# Altium project LeVentilateur.PrjPcb (part 2 of 4)

## Sheet 02-MCU.SchDoc: MCU
size A4
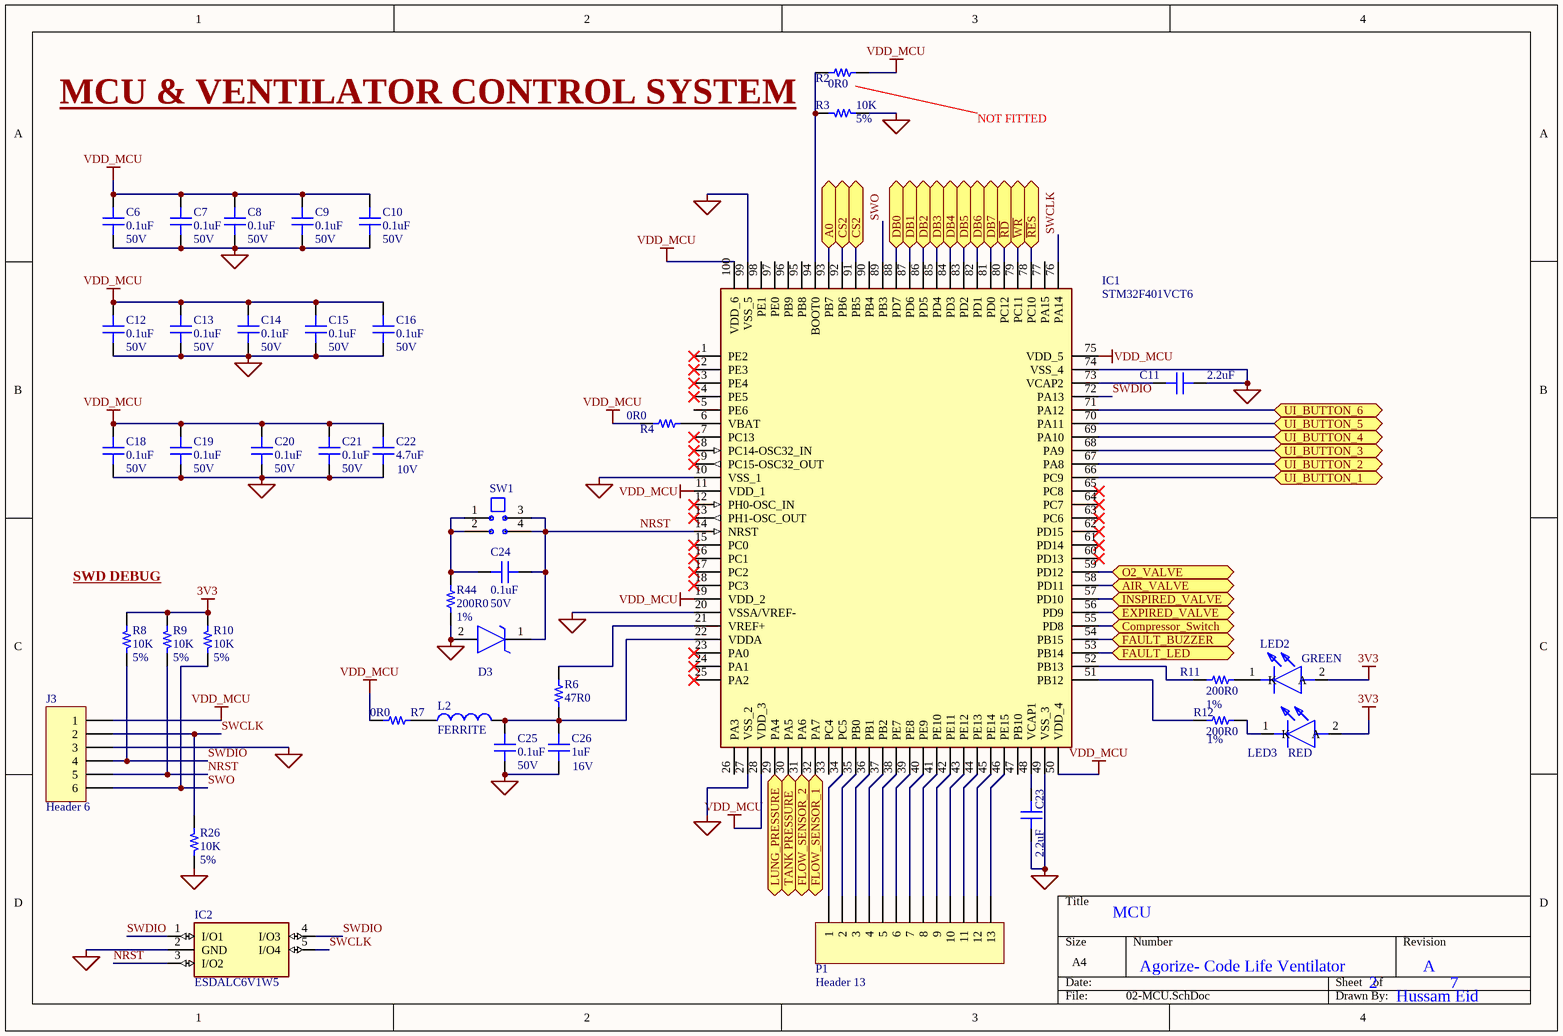
[diagram p1: 02-MCU.SchDoc]

### Parts
C6  0.1uF  Voltage Rating: 50V  [CAP 0603/1608]
C7  0.1uF  Voltage Rating: 50V  [CAP 0603/1608]
C8  0.1uF  Voltage Rating: 50V  [CAP 0603/1608]
C9  0.1uF  Voltage Rating: 50V  [CAP 0603/1608]
C10  0.1uF  Voltage Rating: 50V  [CAP 0603/1608]
C11  2.2uF  [CAP 0603/1608]
C12  0.1uF  Voltage Rating: 50V  [CAP 0603/1608]
C13  0.1uF  Voltage Rating: 50V  [CAP 0603/1608]
C14  0.1uF  Voltage Rating: 50V  [CAP 0603/1608]
C15  0.1uF  Voltage Rating: 50V  [CAP 0603/1608]
C16  0.1uF  Voltage Rating: 50V  [CAP 0603/1608]
C18  0.1uF  Voltage Rating: 50V  [CAP 0603/1608]
C19  0.1uF  Voltage Rating: 50V  [CAP 0603/1608]
C20  0.1uF  Voltage Rating: 50V  [CAP 0603/1608]
C21  0.1uF  Voltage Rating: 50V  [CAP 0603/1608]
C22  4.7uF  Voltage Rating: 10V  [CAP 0603/1608]
C23  2.2uF  [CAP 0603/1608]
C24  0.1uF  Voltage Rating: 50V  [CAP 0603/1608]
C25  0.1uF  Voltage Rating: 50V  [CAP 0603/1608]
C26  1uF  Voltage Rating (DC): 16V  [CAP 0603/1608]
D3  ESDALC6V1-1U2  [ESDALC6V11U2]  (value not drawn)
IC1  STM32F401VCT6  [QFP50P1600X1600X160-100N]
IC2  ESDALC6V1W5  [SOT65P210X110-5N]
J3  Header 6  [HDR1X6]
L2  FERRITE  [BEADC1608X95N]
LED2  GREEN  [150060GS73220]
LED3  RED  [150060GS73220]
P1  Header 13  [HDR1X13]
R2  0R0  [RES 0603/1608]
R3  10K  Tolerance: 5%  [RES 0603/1608]
R4  0R0  [RES 0603/1608]
R6  47R0  [RES 0603/1608]
R7  0R0  [RES 0603/1608]
R8  10K  Tolerance: 5%  [RES 0603/1608]
R9  10K  Tolerance: 5%  [RES 0603/1608]
R10  10K  Tolerance: 5%  [RES 0603/1608]
R11  200R0  Tolerance: 1%  [RES 1206/3216]
R12  200R0  Tolerance: 1%  [RES 1206/3216]
R26  10K  Tolerance: 5%  [RES 0603/1608]
R44  200R0  Tolerance: 1%  [RES 1206/3216]
SW1  Tactle switch  [PTS526SM15SMTR2LFS]  (value not drawn)

### Ports
A0 (bidir), AIR_VALVE (bidir), Compressor_Switch (bidir), CS2 (bidir), DB0 (bidir), DB1 (bidir), DB2 (bidir), DB3 (bidir), DB4 (bidir), DB5 (bidir), DB6 (bidir), DB7 (bidir), EXPIRED_VALVE (bidir), FAULT_BUZZER (bidir), FAULT_LED (bidir), FLOW_SENSOR_1 (bidir), FLOW_SENSOR_2 (bidir), INSPIRED_VALVE (bidir), LUNG_PRESSURE (bidir), O2_VALVE (bidir), TANK PRESSURE (bidir), UI_BUTTON_1 (bidir), UI_BUTTON_2 (bidir), UI_BUTTON_3 (bidir), UI_BUTTON_4 (bidir), UI_BUTTON_5 (bidir), UI_BUTTON_6 (bidir), ~{RD} (bidir), ~{RE}S (bidir), ~{WR} (bidir)

### Nets
3V3: LED2.2(A) LED3.2(A) R8.1 R9.1 R10.1
COM: C6.2 C7.2 C8.2 C9.2 C10.2 C11.2 C12.2 C13.2 C14.2 C15.2 C16.2 C18.2 C19.2 C20.2 C21.2 C22.2 C23.1 C25.2 C26.2 D3.2(A) IC1.10(VSS_1) IC1.20(VSSA/VREF-) IC1.27(VSS_2) IC1.49(VSS_3) IC1.74(VSS_4) IC1.99(VSS_5) IC2.2(GND) J3.3 R3.1 R26.1 R44.1
VDD_MCU: C6.1 C7.1 C8.1 C9.1 C10.1 C12.1 C13.1 C14.1 C15.1 C16.1 C18.1 C19.1 C20.1 C21.1 C22.1 IC1.11(VDD_1) IC1.19(VDD_2) IC1.28(VDD_3) IC1.50(VDD_4) IC1.75(VDD_5) IC1.100(VDD_6) J3.1 R2.2 R4.1 R7.1
NRST: C24.2 D3.1(K) IC1.14(NRST) IC2.3(I/O2) J3.5 R9.2 SW1.3 SW1.4
SWCLK: IC1.76(PA14) IC2.5(I/O4) J3.2 R26.2
SWDIO: IC1.72(PA13) IC2.1(I/O1) IC2.4(I/O3) J3.4 R8.2
SWO: IC1.89(PB3) J3.6 R10.2
NetC11_1: C11.1 IC1.73(VCAP2)
NetC23_2: C23.2 IC1.48(VCAP1)
NetC24_1: C24.1 R44.2 SW1.1 SW1.2
NetC25_1: C25.1 C26.1 IC1.22(VDDA) L2.2 R6.1
NetC55_1: IC1.66(PC9) ; port UI_BUTTON_1
NetC56_1: IC1.67(PA8) ; port UI_BUTTON_2
NetC57_1: IC1.68(PA9) ; port UI_BUTTON_3
NetC58_1: IC1.69(PA10) ; port UI_BUTTON_4
NetC59_1: IC1.70(PA11) ; port UI_BUTTON_5
NetC60_1: IC1.71(PA12) ; port UI_BUTTON_6
NetIC1_6: IC1.6(VBAT) R4.2
NetIC1_21: IC1.21(VREF+) R6.2
NetIC1_29: IC1.29(PA4) ; port LUNG_PRESSURE
NetIC1_30: IC1.30(PA5) ; port TANK PRESSURE
NetIC1_31: IC1.31(PA6) ; port FLOW_SENSOR_2
NetIC1_32: IC1.32(PA7) ; port FLOW_SENSOR_1
NetIC1_34: IC1.34(PC5) P1.1
NetIC1_35: IC1.35(PB0) P1.2
NetIC1_36: IC1.36(PB1) P1.3
NetIC1_37: IC1.37(PB2) P1.4
NetIC1_38: IC1.38(PE7) P1.5
NetIC1_39: IC1.39(PE8) P1.6
NetIC1_40: IC1.40(PE9) P1.7
NetIC1_41: IC1.41(PE10) P1.8
NetIC1_42: IC1.42(PE11) P1.9
NetIC1_43: IC1.43(PE12) P1.10
NetIC1_44: IC1.44(PE13) P1.11
NetIC1_45: IC1.45(PE14) P1.12
NetIC1_46: IC1.46(PE15) P1.13
NetIC1_51: IC1.51(PB12) R12.1
NetIC1_52: IC1.52(PB13) R11.1
NetIC1_53: IC1.53(PB14) ; port FAULT_LED
NetIC1_54: IC1.54(PB15) ; port FAULT_BUZZER
NetIC1_55: IC1.55(PD8) ; port Compressor_Switch
NetIC1_56: IC1.56(PD9) ; port EXPIRED_VALVE
NetIC1_57: IC1.57(PD10) ; port INSPIRED_VALVE
NetIC1_58: IC1.58(PD11) ; port AIR_VALVE
NetIC1_59: IC1.59(PD12) ; port O2_VALVE
NetIC1_78: IC1.78(PC10) ; port ~{RE}S
NetIC1_79: IC1.79(PC11) ; port ~{WR}
NetIC1_80: IC1.80(PC12) ; port ~{RD}
NetIC1_81: IC1.81(PD0) ; port DB7
NetIC1_82: IC1.82(PD1) ; port DB6
NetIC1_83: IC1.83(PD2) ; port DB5
NetIC1_84: IC1.84(PD3) ; port DB4
NetIC1_85: IC1.85(PD4) ; port DB3
NetIC1_86: IC1.86(PD5) ; port DB2
NetIC1_87: IC1.87(PD6) ; port DB1
NetIC1_88: IC1.88(PD7) ; port DB0
NetIC1_91: IC1.91(PB5) IC1.92(PB6) ; port CS2
NetIC1_93: IC1.93(PB7) ; port A0
NetIC1_94: IC1.94(BOOT0) R2.1 R3.2
NetL2_1: L2.1 R7.2
NetLED2_1: LED2.1(K) R11.2
NetLED3_1: LED3.1(K) R12.2

Not connected (* = marked no-connect by the designer): IC1 1(PE2)* 2(PE3)* 3(PE4)* 4(PE5)* 5(PE6) 7(PC13)* 8(PC14-OSC32_IN)* 9(PC15-OSC32_OUT)* 12(PH0-OSC_IN)* 13(PH1-OSC_OUT)* 15(PC0)* 16(PC1)* 17(PC2)* 18(PC3)* 23(PA0)* 24(PA1)* 25(PA2)* 26(PA3) 33(PC4) 47(PB10) 60(PD13)* 61(PD14)* 62(PD15)* 63(PC6)* 64(PC7)* 65(PC8)* 77(PA15) 90(PB4) 95(PB8) 96(PB9) 97(PE0) 98(PE1)

### Notes on the sheet
- MCU & VENTILATOR CONTROL SYSTEM
- NOT FITTED
- SWD DEBUG
- MCU
- Agorize- Code Life Ventilator
- 2
- A
- 7
- Hussam Eid

### Library data of the parts
C6-C10 C12-C16 C18-C21 C24 C25 = C1608X7R1E104K080AA: CAP CER 0.1UF 50V X7R 0603; Manufacturer 1: KEMET; Manufacturer Part Number 1: C0603C104M5RACTU; Description 1: Cap Ceramic 0.1uF 50V X7R 20% SMD 0603 125C T/R; Dielectric Material: Ceramic; Capacitance: 100nF; Tolerance: 20%; Dissipation Factor: 2.5%; ComponentLink1Description: Datasheet; ComponentLink1URL: https://product.tdk.com/info/en/catalog/datasheets/mlcc_commercial_general_en.pdf; ComponentLink2Description: Digi-Key listing; ComponentLink2URL: http://digikey.com/product-detail/en/C1608X7R1E104K080AA/445-1316-1-ND/567697; Supplier 1: Digi-Key; Supplier Part Number 1: 399-7845-1-ND; RoHS 1: Yes; Stock 1: 3475152; Pricing 1: 1 = 0.10000, 10 = 0.03900, 100 = 0.01740, 500 = 0.01240, 1000 = 0.00974 (USD); Mount: Surface Mount,PCB; Case/Package: 0603; Contact Plating: Tin,Matte; Case Code (Metric): 1608; Case Code (Imperial): 0603; Min Operating Temperature: -55°C; Max Operating Temperature: 125°C; Dielectric: X7R; Termination: SMD/SMT; Package Quantity: 1; Packaging: Tape and Reel; Voltage Rating (DC): 50V; Length: 1.6mm; Height: 0.8mm; Thickness: 0.034inch; Lead Pitch: 0.7mm; Depth: 0.8mm; Width: 0.031inch; Radiation Hardening: No; REACH SVHC: No SVHC; ComponentLink3URL: https://www.verical.com/server-webapp/html/getDatasheet?partID=626892&src-supplier=Verical; ComponentLink3Description: https://www.verical.com/server-webapp/html/getDatasheet?partID=626892&src-supplier=Verical; ComponentLink4URL: http://www.farnell.com/datasheets/2746056.pdf?src-supplier=Farnell; ComponentLink4Description: http://www.farnell.com/datasheets/2746056.pdf?src-supplier=Farnell; ComponentLink5URL: http://components.arrow.com/part/dataview/0323_00313986?src-supplier=Arrow+Europe; ComponentLink5Description: http://components.arrow.com/part/dataview/0323_00313986?src-supplier=Arrow+Europe; ComponentLink6URL: http://www.mouser.com/ds/2/212/KEM_C1002_X7R_SMD-1102033.pdf?src-supplier=Mouser; ComponentLink6Description: http://www.mouser.com/ds/2/212/KEM_C1002_X7R_SMD-1102033.pdf?src-supplier=Mouser; ComponentLink7URL: http://www.alliedelec.com/m/d/6f3b5eb83d09db50ed28bdc730567b33.pdf?src-supplier=Allied+Electronics; ComponentLink7Description: http://www.alliedelec.com/m/d/6f3b5eb83d09db50ed28bdc730567b33.pdf?src-supplier=Allied+Electronics; ComponentLink8URL: http://components.arrow.com/part/dataview/40911037S8853915N7429?src-supplier=Arrow; ComponentLink8Description: http://components.arrow.com/part/dataview/40911037S8853915N7429?src-supplier=Arrow; ComponentLink9URL: http://www.farnell.com/datasheets/2746056.pdf?src-supplier=Newark; ComponentLink9Description: http://www.farnell.com/datasheets/2746056.pdf?src-supplier=Newark; ComponentLink10URL: http://www.farnell.com/datasheets/1828800.pdf?src-supplier=Newark; ComponentLink10Description: http://www.farnell.com/datasheets/1828800.pdf?src-supplier=Newark; ComponentLink11URL: http://capacitoredge.kemet.com/capedge2/DataSheet?pn=C0603C104M5RAC7867&src-supplier=Avnet+Asia; ComponentLink11Description: http://capacitoredge.kemet.com/capedge2/DataSheet?pn=C0603C104M5RAC7867&src-supplier=Avnet+Asia; ComponentLink12URL: https://api.kemet.com/component-edge/download/datasheet/C0603C104M5RACTU.pdf?src-supplier=Digi-Key; ComponentLink12Description: https://api.kemet.com/component-edge/download/datasheet/C0603C104M5RACTU.pdf?src-supplier=Digi-Key; ComponentLink13URL: https://www.verical.com/server-webapp/html/getDatasheet?partID=110138&src-supplier=Verical; ComponentLink13Description: https://www.verical.com/server-webapp/html/getDatasheet?partID=110138&src-supplier=Verical; ComponentLink14URL: http://capacitoredge.kemet.com/capedge2/DataSheet?pn=C0603C104M5RAC7867&src-supplier=Avnet; ComponentLink14Description: http://capacitoredge.kemet.com/capedge2/DataSheet?pn=C0603C104M5RAC7867&src-supplier=Avnet; ComponentLink15URL: http://www.farnell.com/datasheets/2315113.pdf?src-supplier=Newark; ComponentLink15Description: http://www.farnell.com/datasheets/2315113.pdf?src-supplier=Newark; ComponentLink16URL: http://www.farnell.com/datasheets/2746056.pdf?src-supplier=Element14; ComponentLink16Description: http://www.farnell.com/datasheets/2746056.pdf?src-supplier=Element14
C11 C23 = C1608X7R1E104K080AA: CAP CER 2.2UF 16V X5R 0603; Manufacturer 1: KEMET; Manufacturer Part Number 1: C0603C225K4PACTU; Description 1: KEMET - C0603C225K4PACTU - CAP, MLCC, X5R, 2.2UF, 16V, 0603; Dielectric Material: Ceramic; Dissipation Factor: 5%; Tolerance: 10%; ComponentLink1Description: Datasheet; ComponentLink1URL: https://product.tdk.com/info/en/catalog/datasheets/mlcc_commercial_general_en.pdf; ComponentLink2Description: Digi-Key listing; ComponentLink2URL: http://digikey.com/product-detail/en/C1608X7R1E104K080AA/445-1316-1-ND/567697; ComponentLink3URL: https://www.verical.com/server-webapp/html/getDatasheet?partID=626892&src-supplier=Verical; ComponentLink3Description: https://www.verical.com/server-webapp/html/getDatasheet?partID=626892&src-supplier=Verical; ComponentLink4URL: http://www.farnell.com/datasheets/2746056.pdf?src-supplier=Farnell; ComponentLink4Description: http://www.farnell.com/datasheets/2746056.pdf?src-supplier=Farnell; ComponentLink5URL: http://components.arrow.com/part/dataview/0323_00313986?src-supplier=Arrow+Europe; ComponentLink5Description: http://components.arrow.com/part/dataview/0323_00313986?src-supplier=Arrow+Europe; ComponentLink6URL: http://www.mouser.com/ds/2/212/KEM_C1002_X7R_SMD-1102033.pdf?src-supplier=Mouser; ComponentLink6Description: http://www.mouser.com/ds/2/212/KEM_C1002_X7R_SMD-1102033.pdf?src-supplier=Mouser; ComponentLink7URL: http://www.alliedelec.com/m/d/6f3b5eb83d09db50ed28bdc730567b33.pdf?src-supplier=Allied+Electronics; ComponentLink7Description: http://www.alliedelec.com/m/d/6f3b5eb83d09db50ed28bdc730567b33.pdf?src-supplier=Allied+Electronics; ComponentLink8URL: http://components.arrow.com/part/dataview/40911037S8853915N7429?src-supplier=Arrow; ComponentLink8Description: http://components.arrow.com/part/dataview/40911037S8853915N7429?src-supplier=Arrow; ComponentLink9URL: http://www.farnell.com/datasheets/2746056.pdf?src-supplier=Newark; ComponentLink9Description: http://www.farnell.com/datasheets/2746056.pdf?src-supplier=Newark; ComponentLink10URL: http://www.farnell.com/datasheets/1828800.pdf?src-supplier=Newark; ComponentLink10Description: http://www.farnell.com/datasheets/1828800.pdf?src-supplier=Newark; ComponentLink11URL: http://capacitoredge.kemet.com/capedge2/DataSheet?pn=C0603C104M5RAC7867&src-supplier=Avnet+Asia; ComponentLink11Description: http://capacitoredge.kemet.com/capedge2/DataSheet?pn=C0603C104M5RAC7867&src-supplier=Avnet+Asia; ComponentLink12URL: https://api.kemet.com/component-edge/download/datasheet/C0603C104M5RACTU.pdf?src-supplier=Digi-Key; ComponentLink12Description: https://api.kemet.com/component-edge/download/datasheet/C0603C104M5RACTU.pdf?src-supplier=Digi-Key; ComponentLink13URL: https://www.verical.com/server-webapp/html/getDatasheet?partID=110138&src-supplier=Verical; ComponentLink13Description: https://www.verical.com/server-webapp/html/getDatasheet?partID=110138&src-supplier=Verical; ComponentLink14URL: http://capacitoredge.kemet.com/capedge2/DataSheet?pn=C0603C104M5RAC7867&src-supplier=Avnet; ComponentLink14Description: http://capacitoredge.kemet.com/capedge2/DataSheet?pn=C0603C104M5RAC7867&src-supplier=Avnet; ComponentLink15URL: http://www.farnell.com/datasheets/2315113.pdf?src-supplier=Newark; ComponentLink15Description: http://www.farnell.com/datasheets/2315113.pdf?src-supplier=Newark; ComponentLink16URL: http://www.farnell.com/datasheets/2746056.pdf?src-supplier=Element14; ComponentLink16Description: http://www.farnell.com/datasheets/2746056.pdf?src-supplier=Element14; ComponentLink17URL: https://datasheet.ciiva.com/30054/131lmk107bj475ka-t-30054339.pdf?src-supplier=Onlinecomponents.com; ComponentLink17Description: https://datasheet.ciiva.com/30054/131lmk107bj475ka-t-30054339.pdf?src-supplier=Onlinecomponents.com; ComponentLink18URL: https://datasheet.ciiva.com/11463/lmk107bj475ka-t-ss-11463768.pdf?src-supplier=Avnet; ComponentLink18Description: https://datasheet.ciiva.com/11463/lmk107bj475ka-t-ss-11463768.pdf?src-supplier=Avnet; ComponentLink19URL: https://datasheet.ciiva.com/135/lmk107bj475ka-t-ss-135643.pdf?src-supplier=Digi-Key; ComponentLink19Description: https://datasheet.ciiva.com/135/lmk107bj475ka-t-ss-135643.pdf?src-supplier=Digi-Key; ComponentLink20URL: https://datasheet.ciiva.com/26872/getdatasheetpartid-638615-26872655.pdf?src-supplier=Verical; ComponentLink20Description: https://datasheet.ciiva.com/26872/getdatasheetpartid-638615-26872655.pdf?src-supplier=Verical; ComponentLink21URL: https://datasheet.ciiva.com/15921/344lmk107bj475ka-t-15921264.pdf?src-supplier=Onlinecomponents.com; ComponentLink21Description: https://datasheet.ciiva.com/15921/344lmk107bj475ka-t-15921264.pdf?src-supplier=Onlinecomponents.com; ComponentLink22URL: https://datasheet.ciiva.com/5424/mlcc01-e-5424565.pdf?src-supplier=Mouser; ComponentLink22Description: https://datasheet.ciiva.com/5424/mlcc01-e-5424565.pdf?src-supplier=Mouser; ComponentLink23URL: https://datasheet.ciiva.com/7975/746258-7975564.pdf?src-supplier=Element14; ComponentLink23Description: https://datasheet.ciiva.com/7975/746258-7975564.pdf?src-supplier=Element14; Supplier 1: Digi-Key; Supplier Part Number 1: 399-7886-1-ND; RoHS 1: Yes; Stock 1: 77145; Pricing 1: 1 = 0.14000, 10 = 0.10300, 100 = 0.04840, 500 = 0.03396, 1000 = 0.02811 (USD); Mount: Surface Mount; Case/Package: 0603; Number of Pins: 2; Contact Plating: Tin,Matte; Case Code (Imperial): 0603; Case Code (Metric): 1608; Min Operating Temperature: -55°C; Max Operating Temperature: 85°C; Capacitance: 2.2uF; Voltage Rating: 16V; Voltage Rating (DC): 16V; Packaging: Tape and Reel; Package Quantity: 1; Termination: SMD/SMT; Voltage: 16V; Dielectric: X5R; Length: 1.6mm; Height: 0.8mm; Width: 0.8mm; Thickness: 0.034inch; Depth: 0.8mm; Radiation Hardening: No; REACH SVHC: No SVHC; Lead Free: Lead Free; ComponentLink24URL: https://datasheet.ciiva.com/5969/1776083-5969304.pdf?src-supplier=Farnell; ComponentLink24Description: https://datasheet.ciiva.com/5969/1776083-5969304.pdf?src-supplier=Farnell; ComponentLink25URL: https://datasheet.ciiva.com/7823/1776083-7823706.pdf?src-supplier=Element14; ComponentLink25Description: https://datasheet.ciiva.com/7823/1776083-7823706.pdf?src-supplier=Element14
C22 = C1608X7R1E104K080AA: CAP CER 4.7UF 10V X5R 0603; Manufacturer 1: Taiyo Yuden; Manufacturer Part Number 1: LMK107BJ475KA-T; Description 1: Cap Ceramic 4.7uF 10V X5R 10% SMD 0603 85C T/R; Dielectric Material: Ceramic; Tolerance: 10%; ComponentLink1Description: Datasheet; ComponentLink1URL: https://product.tdk.com/info/en/catalog/datasheets/mlcc_commercial_general_en.pdf; ComponentLink2Description: Digi-Key listing; ComponentLink2URL: http://digikey.com/product-detail/en/C1608X7R1E104K080AA/445-1316-1-ND/567697; ComponentLink3URL: https://www.verical.com/server-webapp/html/getDatasheet?partID=626892&src-supplier=Verical; ComponentLink3Description: https://www.verical.com/server-webapp/html/getDatasheet?partID=626892&src-supplier=Verical; ComponentLink4URL: http://www.farnell.com/datasheets/2746056.pdf?src-supplier=Farnell; ComponentLink4Description: http://www.farnell.com/datasheets/2746056.pdf?src-supplier=Farnell; ComponentLink5URL: http://components.arrow.com/part/dataview/0323_00313986?src-supplier=Arrow+Europe; ComponentLink5Description: http://components.arrow.com/part/dataview/0323_00313986?src-supplier=Arrow+Europe; ComponentLink6URL: http://www.mouser.com/ds/2/212/KEM_C1002_X7R_SMD-1102033.pdf?src-supplier=Mouser; ComponentLink6Description: http://www.mouser.com/ds/2/212/KEM_C1002_X7R_SMD-1102033.pdf?src-supplier=Mouser; ComponentLink7URL: http://www.alliedelec.com/m/d/6f3b5eb83d09db50ed28bdc730567b33.pdf?src-supplier=Allied+Electronics; ComponentLink7Description: http://www.alliedelec.com/m/d/6f3b5eb83d09db50ed28bdc730567b33.pdf?src-supplier=Allied+Electronics; ComponentLink8URL: http://components.arrow.com/part/dataview/40911037S8853915N7429?src-supplier=Arrow; ComponentLink8Description: http://components.arrow.com/part/dataview/40911037S8853915N7429?src-supplier=Arrow; ComponentLink9URL: http://www.farnell.com/datasheets/2746056.pdf?src-supplier=Newark; ComponentLink9Description: http://www.farnell.com/datasheets/2746056.pdf?src-supplier=Newark; ComponentLink10URL: http://www.farnell.com/datasheets/1828800.pdf?src-supplier=Newark; ComponentLink10Description: http://www.farnell.com/datasheets/1828800.pdf?src-supplier=Newark; ComponentLink11URL: http://capacitoredge.kemet.com/capedge2/DataSheet?pn=C0603C104M5RAC7867&src-supplier=Avnet+Asia; ComponentLink11Description: http://capacitoredge.kemet.com/capedge2/DataSheet?pn=C0603C104M5RAC7867&src-supplier=Avnet+Asia; ComponentLink12URL: https://api.kemet.com/component-edge/download/datasheet/C0603C104M5RACTU.pdf?src-supplier=Digi-Key; ComponentLink12Description: https://api.kemet.com/component-edge/download/datasheet/C0603C104M5RACTU.pdf?src-supplier=Digi-Key; ComponentLink13URL: https://www.verical.com/server-webapp/html/getDatasheet?partID=110138&src-supplier=Verical; ComponentLink13Description: https://www.verical.com/server-webapp/html/getDatasheet?partID=110138&src-supplier=Verical; ComponentLink14URL: http://capacitoredge.kemet.com/capedge2/DataSheet?pn=C0603C104M5RAC7867&src-supplier=Avnet; ComponentLink14Description: http://capacitoredge.kemet.com/capedge2/DataSheet?pn=C0603C104M5RAC7867&src-supplier=Avnet; ComponentLink15URL: http://www.farnell.com/datasheets/2315113.pdf?src-supplier=Newark; ComponentLink15Description: http://www.farnell.com/datasheets/2315113.pdf?src-supplier=Newark; ComponentLink16URL: http://www.farnell.com/datasheets/2746056.pdf?src-supplier=Element14; ComponentLink16Description: http://www.farnell.com/datasheets/2746056.pdf?src-supplier=Element14; Supplier 1: Digi-Key; Supplier Part Number 1: 587-1441-1-ND; RoHS 1: Yes; Stock 1: 2625329; Pricing 1: 1 = 0.19000, 10 = 0.12700, 100 = 0.06440, 500 = 0.04408, 1000 = 0.03899 (USD); Mount: Surface Mount; Case/Package: 0603; Number of Pins: 2; Case Code (Imperial): 0603; Case Code (Metric): 1608; Contact Plating: Nickel; Min Operating Temperature: -55°C; Max Operating Temperature: 85°C; Dielectric: X5R; Voltage Rating (DC): 10V; Capacitance: 4.7uF; Packaging: Tape and Reel; Termination: SMD/SMT; Package Quantity: 1; Length: 1.6mm; Height: 0.8mm; Width: 0.031inch; Thickness: 0.035inch; Depth: 0.8mm; Radiation Hardening: No; Halogen Free: Halogen Free; Lead Free: Lead Free; REACH SVHC: Unknown; ComponentLink17URL: https://datasheet.ciiva.com/30054/131lmk107bj475ka-t-30054339.pdf?src-supplier=Onlinecomponents.com; ComponentLink17Description: https://datasheet.ciiva.com/30054/131lmk107bj475ka-t-30054339.pdf?src-supplier=Onlinecomponents.com; ComponentLink18URL: https://datasheet.ciiva.com/11463/lmk107bj475ka-t-ss-11463768.pdf?src-supplier=Avnet; ComponentLink18Description: https://datasheet.ciiva.com/11463/lmk107bj475ka-t-ss-11463768.pdf?src-supplier=Avnet; ComponentLink19URL: https://datasheet.ciiva.com/135/lmk107bj475ka-t-ss-135643.pdf?src-supplier=Digi-Key; ComponentLink19Description: https://datasheet.ciiva.com/135/lmk107bj475ka-t-ss-135643.pdf?src-supplier=Digi-Key; ComponentLink20URL: https://datasheet.ciiva.com/26872/getdatasheetpartid-638615-26872655.pdf?src-supplier=Verical; ComponentLink20Description: https://datasheet.ciiva.com/26872/getdatasheetpartid-638615-26872655.pdf?src-supplier=Verical; ComponentLink21URL: https://datasheet.ciiva.com/15921/344lmk107bj475ka-t-15921264.pdf?src-supplier=Onlinecomponents.com; ComponentLink21Description: https://datasheet.ciiva.com/15921/344lmk107bj475ka-t-15921264.pdf?src-supplier=Onlinecomponents.com; ComponentLink22URL: https://datasheet.ciiva.com/5424/mlcc01-e-5424565.pdf?src-supplier=Mouser; ComponentLink22Description: https://datasheet.ciiva.com/5424/mlcc01-e-5424565.pdf?src-supplier=Mouser; ComponentLink23URL: https://datasheet.ciiva.com/7975/746258-7975564.pdf?src-supplier=Element14; ComponentLink23Description: https://datasheet.ciiva.com/7975/746258-7975564.pdf?src-supplier=Element14
C26 = C1608X7R1E104K080AA: CAP CER 1UF 16V X7R 0603; Manufacturer 1: KEMET; Manufacturer Part Number 1: C0603C104M5RACTU; Description 1: Cap Ceramic 0.1uF 50V X7R 20% SMD 0603 125C T/R; Dielectric Material: Ceramic; Capacitance: 100nF; Tolerance: 20%; Dissipation Factor: 2.5%; Voltage Rating: 16; Description 2: SAMSUNG ELECTRO-MECHANICS - CL10B105MO8NNWC - SMD Multilayer Ceramic Capacitor, 1 µF, 16 V, 0603 [1608 Metric], ± 20%, X7R, CL Series; ComponentLink1Description: Datasheet; ComponentLink1URL: https://product.tdk.com/info/en/catalog/datasheets/mlcc_commercial_general_en.pdf; ComponentLink2Description: Digi-Key listing; ComponentLink2URL: http://digikey.com/product-detail/en/C1608X7R1E104K080AA/445-1316-1-ND/567697; Supplier 1: Digi-Key; Supplier Part Number 1: 399-7845-1-ND; RoHS 1: Yes; Stock 1: 3475152; Pricing 1: 1 = 0.10000, 10 = 0.03900, 100 = 0.01740, 500 = 0.01240, 1000 = 0.00974 (USD); Mount: Surface Mount,PCB; Case/Package: 0603; Contact Plating: Tin,Matte; Case Code (Metric): 1608; Case Code (Imperial): 0603; Min Operating Temperature: -55°C; Max Operating Temperature: 125°C; Dielectric: X7R; Termination: SMD/SMT; Package Quantity: 1; Packaging: Tape and Reel; Length: 1.6mm; Height: 0.8mm; Thickness: 0.034inch; Lead Pitch: 0.7mm; Depth: 0.8mm; Width: 0.031inch; Radiation Hardening: No; REACH SVHC: No SVHC; ComponentLink3URL: https://www.verical.com/server-webapp/html/getDatasheet?partID=626892&src-supplier=Verical; ComponentLink3Description: https://www.verical.com/server-webapp/html/getDatasheet?partID=626892&src-supplier=Verical; ComponentLink4URL: http://www.farnell.com/datasheets/2746056.pdf?src-supplier=Farnell; ComponentLink4Description: http://www.farnell.com/datasheets/2746056.pdf?src-supplier=Farnell; ComponentLink5URL: http://components.arrow.com/part/dataview/0323_00313986?src-supplier=Arrow+Europe; ComponentLink5Description: http://components.arrow.com/part/dataview/0323_00313986?src-supplier=Arrow+Europe; ComponentLink6URL: http://www.mouser.com/ds/2/212/KEM_C1002_X7R_SMD-1102033.pdf?src-supplier=Mouser; ComponentLink6Description: http://www.mouser.com/ds/2/212/KEM_C1002_X7R_SMD-1102033.pdf?src-supplier=Mouser; ComponentLink7URL: http://www.alliedelec.com/m/d/6f3b5eb83d09db50ed28bdc730567b33.pdf?src-supplier=Allied+Electronics; ComponentLink7Description: http://www.alliedelec.com/m/d/6f3b5eb83d09db50ed28bdc730567b33.pdf?src-supplier=Allied+Electronics; ComponentLink8URL: http://components.arrow.com/part/dataview/40911037S8853915N7429?src-supplier=Arrow; ComponentLink8Description: http://components.arrow.com/part/dataview/40911037S8853915N7429?src-supplier=Arrow; ComponentLink9URL: http://www.farnell.com/datasheets/2746056.pdf?src-supplier=Newark; ComponentLink9Description: http://www.farnell.com/datasheets/2746056.pdf?src-supplier=Newark; ComponentLink10URL: http://www.farnell.com/datasheets/1828800.pdf?src-supplier=Newark; ComponentLink10Description: http://www.farnell.com/datasheets/1828800.pdf?src-supplier=Newark; ComponentLink11URL: http://capacitoredge.kemet.com/capedge2/DataSheet?pn=C0603C104M5RAC7867&src-supplier=Avnet+Asia; ComponentLink11Description: http://capacitoredge.kemet.com/capedge2/DataSheet?pn=C0603C104M5RAC7867&src-supplier=Avnet+Asia; ComponentLink12URL: https://api.kemet.com/component-edge/download/datasheet/C0603C104M5RACTU.pdf?src-supplier=Digi-Key; ComponentLink12Description: https://api.kemet.com/component-edge/download/datasheet/C0603C104M5RACTU.pdf?src-supplier=Digi-Key; ComponentLink13URL: https://www.verical.com/server-webapp/html/getDatasheet?partID=110138&src-supplier=Verical; ComponentLink13Description: https://www.verical.com/server-webapp/html/getDatasheet?partID=110138&src-supplier=Verical; ComponentLink14URL: http://capacitoredge.kemet.com/capedge2/DataSheet?pn=C0603C104M5RAC7867&src-supplier=Avnet; ComponentLink14Description: http://capacitoredge.kemet.com/capedge2/DataSheet?pn=C0603C104M5RAC7867&src-supplier=Avnet; ComponentLink15URL: http://www.farnell.com/datasheets/2315113.pdf?src-supplier=Newark; ComponentLink15Description: http://www.farnell.com/datasheets/2315113.pdf?src-supplier=Newark; ComponentLink16URL: http://www.farnell.com/datasheets/2746056.pdf?src-supplier=Element14; ComponentLink16Description: http://www.farnell.com/datasheets/2746056.pdf?src-supplier=Element14; Supplier 2: Digi-Key; Supplier Part Number 2: 1276-6524-1-ND; Manufacturer 2: Samsung; Manufacturer Part Number 2: CL10B105MO8NNWC; RoHS 2: Yes; Stock 2: 9459126; Pricing 2: 1 = 0.10000, 10 = 0.04600, 100 = 0.02050, 500 = 0.01464, 1000 = 0.01150 (USD); ComponentLink17URL: https://media.digikey.com/pdf/Data%20Sheets/Samsung%20PDFs/CL10B105MO8NNWC.pdf?src-supplier=Digi-Key; ComponentLink17Description: https://media.digikey.com/pdf/Data%20Sheets/Samsung%20PDFs/CL10B105MO8NNWC.pdf?src-supplier=Digi-Key; ComponentLink18URL: http://www.farnell.com/datasheets/2710574.pdf?src-supplier=Farnell; ComponentLink18Description: http://www.farnell.com/datasheets/2710574.pdf?src-supplier=Farnell; ComponentLink19URL: http://www.farnell.com/datasheets/2710574.pdf?src-supplier=Element14; ComponentLink19Description: http://www.farnell.com/datasheets/2710574.pdf?src-supplier=Element14; ComponentLink20URL: http://www.farnell.com/datasheets/2710574.pdf?src-supplier=Newark; ComponentLink20Description: http://www.farnell.com/datasheets/2710574.pdf?src-supplier=Newark
D3 = ESDALC6V1-1U2: TVS Diode (Uni-directional); Manufacturer_Name: STMicroelectronics; Allied_Number: 70389949; Datasheet Link: http://www.st.com/web/en/resource/technical/document/datasheet/CD00212838.pdf; Height: 0mm; Manufacturer_Part_Number: ESDALC6V1-1U2; Mouser Part Number: 511-ESDALC6V1-1U2; Mouser Price/Stock: https://www.mouser.com/Search/Refine.aspx?Keyword=511-ESDALC6V1-1U2; RS Part Number: 7958404P; RS Price/Stock: http://uk.rs-online.com/web/p/products/7958404P; Allied Price/Stock: http://www.alliedelec.com/stmicroelectronics-esdalc6v1-1u2/70389949/; Manufacturer Part Number 1: ESDALC6V1-1U2; Manufacturer 1: STMicroelectronics
IC1 = STM32F401VCT6: ARM® Cortex®-M4 STM32F4 Microcontroller IC 32-Bit 84MHz 256KB (256K x 8) FLASH 100-LQFP (14x14); Manufacturer_Name: STMicroelectronics; Allied_Number: 70391098; Datasheet Link: http://www.st.com/web/en/resource/technical/document/datasheet/DM00086815.pdf; Height: 1.6mm; Manufacturer_Part_Number: STM32F401VCT6; Mouser Part Number: 511-STM32F401VCT6; Mouser Price/Stock: https://www.mouser.com/Search/Refine.aspx?Keyword=511-STM32F401VCT6; RS Part Number: 7926019P; RS Price/Stock: http://uk.rs-online.com/web/p/products/7926019P; Allied Price/Stock: http://www.alliedelec.com/stmicroelectronics-stm32f401vct6/70391098/; Manufacturer Part Number 1: STM32F401VCT6; Manufacturer 1: STMicroelectronics
IC2 = ESDALC6V1W5: Clamp  Ipp Tvs Diode Surface Mount SOT-323-5; Manufacturer_Name: STMicroelectronics; Allied_Number: 70389952; Datasheet Link: http://www.st.com/web/en/resource/technical/document/datasheet/CD00002946.pdf; Height: 1.1mm; Manufacturer_Part_Number: ESDALC6V1W5; Mouser Part Number: 511-ESDALC6V1W5; Mouser Price/Stock: https://www.mouser.com/Search/Refine.aspx?Keyword=511-ESDALC6V1W5; RS Part Number: 1787373; RS Price/Stock: https://uk.rs-online.com/web/p/products/1787373; Allied Price/Stock: http://www.alliedelec.com/stmicroelectronics-esdalc6v1w5/70389952/; Manufacturer Part Number 1: ESDALC6V1W5; Manufacturer 1: STMicroelectronics
J3 = Header 6: Header, 6-Pin; Manufacturer 1: Sullins; Manufacturer Part Number 1: PRPC006SACN-RC; Description 1: CONN HEADER VERT 6POS 2.54MM; Number of Positions: 6; Connector Type: Male Pin; Pitch: 0.1inch; LatestRevisionDate: 17-Jul-2002; LatestRevisionNote: Re-released for DXP Platform.; Publisher: Altium Limited; Supplier 1: Digi-Key; Supplier Part Number 1: S1131EC-06-ND; RoHS 1: Yes; Stock 1: 695; Pricing 1: 1 = 0.25000, 10 = 0.23600, 25 = 0.20120, 50 = 0.17580, 100 = 0.16330, 250 = 0.14448, 500 = 0.13820 (USD); Mount: Through Hole; Color: Black; Contact Plating: Gold; Package Quantity: 1; Number of Rows: 1; Packaging: Bulk; Termination: Solder; Contact Mating Length: 0.23inch; ComponentLink1URL: https://datasheet.ciiva.com/741/xrxczzzsxxn-rc-st-11635-b-741959.pdf?src-supplier=Digi-Key; ComponentLink1Description: https://datasheet.ciiva.com/741/xrxczzzsxxn-rc-st-11635-b-741959.pdf?src-supplier=Digi-Key
L2 = Inductor: FERRITE BEAD 300 OHM 0603 1LN; Manufacturer 1: Vishay Dale; Manufacturer Part Number 1: ILBB0603ER301V; Impedance: 300R; Tolerance: 25%; Current Rating: 150mA; Shielding: Shielded; DC Resistance (DCR): 350mR; Test Frequency: 100MHz; Number of Lines: 1; Inductance: 300uH; Supplier 1: Digi-Key; Supplier Part Number 1: 541-2291-1-ND; RoHS 1: Yes; Description 1: FERRITE BEAD 300 OHM 0603; Stock 1: 4680; Pricing 1: 1 = 0.10000, 10 = 0.07300, 25 = 0.06600, 50 = 0.05940, 100 = 0.04360, 250 = 0.03168, 500 = 0.02904, 1000 = 0.02508 (USD); Mount: Surface Mount; Case/Package: 0603; Number of Pins: 2; Weight: 7.1E-05oz; Case Code (Metric): 1608; Core Material: Ferrite; Case Code (Imperial): 0603; Min Operating Temperature: -55°C; Max Operating Temperature: 125°C; Packaging: Tape and Reel; Package Quantity: 1; Termination: SMD/SMT; Max DC Current: 150mA; Max Current Rating: 150mA; DC Current: 150mA; Military Standard: Not; Length: 0.063inch; Height: 0.037inch; Width: 0.8mm; Depth: 0.95mm; Radiation Hardening: No; Lead Free: Lead Free; REACH SVHC: Unknown; ComponentLink1URL: https://datasheet.ciiva.com/4939/ilbb0603-239824-4939552.pdf?src-supplier=Mouser; ComponentLink1Description: https://datasheet.ciiva.com/4939/ilbb0603-239824-4939552.pdf?src-supplier=Mouser; ComponentLink2URL: https://datasheet.ciiva.com/15160/getdatasheetpartid-45515-15160141.pdf?src-supplier=Verical; ComponentLink2Description: https://datasheet.ciiva.com/15160/getdatasheetpartid-45515-15160141.pdf?src-supplier=Verical; ComponentLink3URL: https://datasheet.ciiva.com/46636/ilbb0603-46636055.pdf?src-supplier=Digi-Key; ComponentLink3Description: https://datasheet.ciiva.com/46636/ilbb0603-46636055.pdf?src-supplier=Digi-Key; ComponentLink4URL: https://datasheet.ciiva.com/46417/ilbb0603-46417096.pdf?src-supplier=Element14; ComponentLink4Description: https://datasheet.ciiva.com/46417/ilbb0603-46417096.pdf?src-supplier=Element14; ComponentLink5URL: https://datasheet.ciiva.com/8493/ilbb0603-8493945.pdf?src-supplier=Avnet; ComponentLink5Description: https://datasheet.ciiva.com/8493/ilbb0603-8493945.pdf?src-supplier=Avnet; ComponentLink6URL: https://datasheet.ciiva.com/1014/ilbb0603-1014734.pdf?src-supplier=Digi-Key; ComponentLink6Description: https://datasheet.ciiva.com/1014/ilbb0603-1014734.pdf?src-supplier=Digi-Key
LED2 = 150060GS73220: LED GREEN CLEAR 0603 SMD; Manufacturer 1: Wurth Electronics; Manufacturer Part Number 1: 150060VS75000; Description 1: WURTH ELEKTRONIK - 150060VS75000 - LED, Grün, Oberflächenmontage, 603, 30 mA, 2 V, 570 nm; Luminous Intensity: 40mcd; Viewing Angle: 140°; Forward Voltage: 2V; Wavelength: 570nm; Lens Style: Clear,Rectangular; Forward Current: 30mA; Test Current: 20mA; Supplier 1: Digi-Key; Supplier Part Number 1: 732-4980-1-ND; RoHS 1: Yes; Stock 1: 29468; Pricing 1: 1 = 0.14000, 50 = 0.13300, 100 = 0.11400, 500 = 0.09900 (USD); Mount: Surface Mount; Case/Package: 0603; Number of Pins: 2; Case Code (Metric): 1608; Case Code (Imperial): 0603; Color: Green; Min Operating Temperature: -40°C; Max Operating Temperature: 85°C; Package Quantity: 1; Packaging: Tape and Reel; Dominant Wavelength: 570nm; Length: 1.6mm; Height: 0.7mm; Width: 0.8mm; REACH SVHC: Unknown; ComponentLink1URL: https://datasheet.ciiva.com/29562/150060vs75000-29562919.pdf?src-supplier=Digi-Key; ComponentLink1Description: https://datasheet.ciiva.com/29562/150060vs75000-29562919.pdf?src-supplier=Digi-Key
LED3 = 150060GS73220: LED GREEN CLEAR 0603 SMD; Manufacturer 1: Wurth Electronics; Manufacturer Part Number 1: 150060RS75000; Description 1: WURTH ELEKTRONIK - 150060RS75000 - LED, Red, 625 nm, 2 V, 30 mA, 250 mcd RoHS Compliant: Yes; Viewing Angle: 140°; Lens Style: Clear,Rectangular; Luminous Intensity: 250mcd; Forward Current: 30mA; Forward Voltage: 2V; Wavelength: 625nm; Test Current: 20mA; ComponentLink1URL: https://datasheet.ciiva.com/29562/150060vs75000-29562919.pdf?src-supplier=Digi-Key; ComponentLink1Description: https://datasheet.ciiva.com/29562/150060vs75000-29562919.pdf?src-supplier=Digi-Key; Supplier 1: Digi-Key; Supplier Part Number 1: 732-4978-1-ND; RoHS 1: Yes; Stock 1: 20136; Pricing 1: 1 = 0.14000, 50 = 0.13300, 100 = 0.11400, 500 = 0.09900 (USD); Mount: Surface Mount; Case/Package: 0603; Case Code (Imperial): 0603; Color: Red; Case Code (Metric): 1608; Min Operating Temperature: -40°C; Max Operating Temperature: 85°C; Package Quantity: 1; Packaging: Cut Tape; Dominant Wavelength: 625nm; Length: 1.6mm; Height: 0.7mm; Width: 0.8mm; REACH SVHC: Unknown; ComponentLink2URL: https://datasheet.ciiva.com/29563/150060rs75000-29563040.pdf?src-supplier=Digi-Key; ComponentLink2Description: https://datasheet.ciiva.com/29563/150060rs75000-29563040.pdf?src-supplier=Digi-Key; ComponentLink3URL: https://datasheet.ciiva.com/29279/759428-da-01-en-chipled-0603-w-kl-rot-150060rs75000-29279196.pdf?src-supplier=Conrad; ComponentLink3Description: https://datasheet.ciiva.com/29279/759428-da-01-en-chipled-0603-w-kl-rot-150060rs75000-29279196.pdf?src-supplier=Conrad
P1 = Header 13: Header, 13-Pin; Manufacturer 1: Sullins; Manufacturer Part Number 1: PREC013SAAN-RC; Description 1: CONN HEADER .100 SNGL STR 13POS; Number of Positions: 13; Connector Type: Male Pin; Pitch: 0.1inch; LatestRevisionDate: 17-Jul-2002; LatestRevisionNote: Re-released for DXP Platform.; Publisher: Altium Limited; Supplier 1: Digi-Key; Supplier Part Number 1: S1012EC-13-ND; RoHS 1: Yes; Stock 1: 1831; Pricing 1: 1 = 0.29000, 10 = 0.27000, 25 = 0.23160, 50 = 0.19700, 100 = 0.18920, 250 = 0.16988, 500 = 0.16216 (USD); Mount: Through Hole; Color: Black; Contact Plating: Tin; Package Quantity: 1; Number of Rows: 1; Packaging: Bulk; Termination: Solder; Contact Mating Length: 0.23inch; ComponentLink1URL: https://datasheet.ciiva.com/740/zrzczzzszzn-rc-st-11635-b-740832.pdf?src-supplier=Digi-Key; ComponentLink1Description: https://datasheet.ciiva.com/740/zrzczzzszzn-rc-st-11635-b-740832.pdf?src-supplier=Digi-Key
R2 R4 R7 = ERJ-3EKF1001V: RES SMD 0 OHM JUMPER 1/10W 0603; Manufacturer 1: Panasonic; Manufacturer Part Number 1: ERJ-3GEY0R00V; Description 1: Res Thick Film 0603 0 Ohm Jumper Molded SMD Punched Carrier T/R; Resistance: 0mR; Power Rating: 100mW; Voltage Rating: 75V; Tolerance: 0%; Voltage Rating (DC): 50V; Temperature Coefficient: 600ppm/°C; ComponentLink1Description: Datasheet; ComponentLink1URL: http://industrial.panasonic.com/www-cgi/jvcr13pz.cgi?E+PZ+3+AOA0002+ERJ3EKF1001V+7+WW; ComponentLink2Description: Digi-Key listing; ComponentLink2URL: http://digikey.com/product-detail/en/ERJ-3EKF1001V/P1.00KHTR-ND/196032; Supplier 1: Digi-Key; Supplier Part Number 1: P0.0GDKR-ND; RoHS 1: Yes; Stock 1: 17444338; Pricing 1: 1 = 0.10000, 10 = 0.03800, 25 = 0.02760, 50 = 0.02120, 100 = 0.01560, 250 = 0.01188, 500 = 0.00950, 1000 = 0.00700 (USD); Mount: Surface Mount; Case/Package: 0603; Contact Plating: Tin; Case Code (Metric): 1608; Case Code (Imperial): 0603; Min Operating Temperature: -55°C; Max Operating Temperature: 155°C; Composition: Thick Film; Packaging: Tape and Reel; Package Quantity: 1; Number of Terminations: 2; Termination: SMD/SMT; Military Standard: Not; Features: Automotive AEC-Q200; Max Power Dissipation: 100mW; Length: 1.6mm; Height: 0.45mm; Width: 0.031inch; Depth: 0.8mm; Radiation Hardening: No; Lead Free: Lead Free; REACH SVHC: No SVHC; ComponentLink3URL: https://datasheet.ciiva.com/27055/1935748-27055113.pdf?src-supplier=Jameco; ComponentLink3Description: https://datasheet.ciiva.com/27055/1935748-27055113.pdf?src-supplier=Jameco; ComponentLink4URL: https://datasheet.ciiva.com/11808/0900766b80f806dd-11808207.pdf?src-supplier=RSComponents; ComponentLink4Description: https://datasheet.ciiva.com/11808/0900766b80f806dd-11808207.pdf?src-supplier=RSComponents; ComponentLink5URL: https://datasheet.ciiva.com/48532/aoa0000ce1-48532165.pdf?src-supplier=Avnet; ComponentLink5Description: https://datasheet.ciiva.com/48532/aoa0000ce1-48532165.pdf?src-supplier=Avnet; ComponentLink6URL: https://datasheet.ciiva.com/43460/1678796-43460647.pdf?src-supplier=Farnell; ComponentLink6Description: https://datasheet.ciiva.com/43460/1678796-43460647.pdf?src-supplier=Farnell; ComponentLink7URL: https://datasheet.ciiva.com/28695/1678796-28695833.pdf?src-supplier=Element14; ComponentLink7Description: https://datasheet.ciiva.com/28695/1678796-28695833.pdf?src-supplier=Element14; ComponentLink8URL: https://datasheet.ciiva.com/5959/1678796-5959707.pdf?src-supplier=Farnell; ComponentLink8Description: https://datasheet.ciiva.com/5959/1678796-5959707.pdf?src-supplier=Farnell; ComponentLink9URL: https://datasheet.ciiva.com/46377/1678796-46377868.pdf?src-supplier=Element14; ComponentLink9Description: https://datasheet.ciiva.com/46377/1678796-46377868.pdf?src-supplier=Element14; ComponentLink10URL: https://datasheet.ciiva.com/9198/aoa0000ce1-9198975.pdf?src-supplier=Avnet; ComponentLink10Description: https://datasheet.ciiva.com/9198/aoa0000ce1-9198975.pdf?src-supplier=Avnet; ComponentLink11URL: https://datasheet.ciiva.com/16758/70255313-16758527.pdf?src-supplier=Allied+Electronics; ComponentLink11Description: https://datasheet.ciiva.com/16758/70255313-16758527.pdf?src-supplier=Allied+Electronics; ComponentLink12URL: https://datasheet.ciiva.com/16834/aoa0000ce1-16834828.pdf?src-supplier=Future+Electronics; ComponentLink12Description: https://datasheet.ciiva.com/16834/aoa0000ce1-16834828.pdf?src-supplier=Future+Electronics; ComponentLink13URL: https://datasheet.ciiva.com/17215/aoa0000ce1-17215388.pdf?src-supplier=Avnet+Europe; ComponentLink13Description: https://datasheet.ciiva.com/17215/aoa0000ce1-17215388.pdf?src-supplier=Avnet+Europe; ComponentLink14URL: https://datasheet.ciiva.com/30199/4aoa0000ce1-30199822.pdf?src-supplier=Onlinecomponents.com; ComponentLink14Description: https://datasheet.ciiva.com/30199/4aoa0000ce1-30199822.pdf?src-supplier=Onlinecomponents.com
R3 R8-R10 R26 = ERJ-3EKF1001V: RES SMD 10K OHM 5% 1/10W 0603; Manufacturer 1: Yageo; Manufacturer Part Number 1: RC0603JR-0710KL; Description 1: Surface Mount Thick Film Resistor, RC Series, 10 kohm, 100 mW, - 5%, 50 V, 0603 [1608 Metric]; Temperature Coefficient: 100ppm/°C; Resistance: 10kR; Voltage Rating (DC): 50V; Max Power Dissipation: 100mW; ComponentLink1Description: Datasheet; ComponentLink1URL: http://industrial.panasonic.com/www-cgi/jvcr13pz.cgi?E+PZ+3+AOA0002+ERJ3EKF1001V+7+WW; ComponentLink2Description: Digi-Key listing; ComponentLink2URL: http://digikey.com/product-detail/en/ERJ-3EKF1001V/P1.00KHTR-ND/196032; ComponentLink3URL: https://datasheet.ciiva.com/27055/1935748-27055113.pdf?src-supplier=Jameco; ComponentLink3Description: https://datasheet.ciiva.com/27055/1935748-27055113.pdf?src-supplier=Jameco; ComponentLink4URL: https://datasheet.ciiva.com/11808/0900766b80f806dd-11808207.pdf?src-supplier=RSComponents; ComponentLink4Description: https://datasheet.ciiva.com/11808/0900766b80f806dd-11808207.pdf?src-supplier=RSComponents; ComponentLink5URL: https://datasheet.ciiva.com/48532/aoa0000ce1-48532165.pdf?src-supplier=Avnet; ComponentLink5Description: https://datasheet.ciiva.com/48532/aoa0000ce1-48532165.pdf?src-supplier=Avnet; ComponentLink6URL: https://datasheet.ciiva.com/43460/1678796-43460647.pdf?src-supplier=Farnell; ComponentLink6Description: https://datasheet.ciiva.com/43460/1678796-43460647.pdf?src-supplier=Farnell; ComponentLink7URL: https://datasheet.ciiva.com/28695/1678796-28695833.pdf?src-supplier=Element14; ComponentLink7Description: https://datasheet.ciiva.com/28695/1678796-28695833.pdf?src-supplier=Element14; ComponentLink8URL: https://datasheet.ciiva.com/5959/1678796-5959707.pdf?src-supplier=Farnell; ComponentLink8Description: https://datasheet.ciiva.com/5959/1678796-5959707.pdf?src-supplier=Farnell; ComponentLink9URL: https://datasheet.ciiva.com/46377/1678796-46377868.pdf?src-supplier=Element14; ComponentLink9Description: https://datasheet.ciiva.com/46377/1678796-46377868.pdf?src-supplier=Element14; ComponentLink10URL: https://datasheet.ciiva.com/9198/aoa0000ce1-9198975.pdf?src-supplier=Avnet; ComponentLink10Description: https://datasheet.ciiva.com/9198/aoa0000ce1-9198975.pdf?src-supplier=Avnet; ComponentLink11URL: https://datasheet.ciiva.com/16758/70255313-16758527.pdf?src-supplier=Allied+Electronics; ComponentLink11Description: https://datasheet.ciiva.com/16758/70255313-16758527.pdf?src-supplier=Allied+Electronics; ComponentLink12URL: https://datasheet.ciiva.com/16834/aoa0000ce1-16834828.pdf?src-supplier=Future+Electronics; ComponentLink12Description: https://datasheet.ciiva.com/16834/aoa0000ce1-16834828.pdf?src-supplier=Future+Electronics; ComponentLink13URL: https://datasheet.ciiva.com/17215/aoa0000ce1-17215388.pdf?src-supplier=Avnet+Europe; ComponentLink13Description: https://datasheet.ciiva.com/17215/aoa0000ce1-17215388.pdf?src-supplier=Avnet+Europe; ComponentLink14URL: https://datasheet.ciiva.com/30199/4aoa0000ce1-30199822.pdf?src-supplier=Onlinecomponents.com; ComponentLink14Description: https://datasheet.ciiva.com/30199/4aoa0000ce1-30199822.pdf?src-supplier=Onlinecomponents.com; Supplier 1: Digi-Key; Supplier Part Number 1: 311-10KGRCT-ND; RoHS 1: Yes; Stock 1: 3333728; Pricing 1: 1 = 0.10000, 10 = 0.01900, 100 = 0.00770, 1000 = 0.00347, 2500 = 0.00301 (USD); Case/Package: 0603; Number of Pins: 2; Contact Plating: Tin,Matte; Case Code (Imperial): 0603; Case Code (Metric): 1608; Min Operating Temperature: -55°C; Max Operating Temperature: 155°C; Composition: Thick Film; Packaging: Tape and Reel; Features: Moisture Resistant; Number of Terminations: 2; Termination: SMD/SMT; Military Standard: Not; Power Rating: 100mW; Voltage Rating: 50V; Length: 0.063inch; Width: 0.031inch; Height - Seated (Max): 0.022inch; Depth: 0.8mm; Radiation Hardening: No; Lead Free: Lead Free; REACH SVHC: Unknown; ComponentLink15URL: https://datasheet.ciiva.com/2452/pyu-rc-group-51-rohs-l-10-2452848.pdf?src-supplier=Digi-Key; ComponentLink15Description: https://datasheet.ciiva.com/2452/pyu-rc-group-51-rohs-l-10-2452848.pdf?src-supplier=Digi-Key
R6 = ERJ-3EKF1001V: RESISTOR 47 Ohms ±5% 0.1W, 1/10W Chip Resistor 0603; Manufacturer 1: TE Connectivity; Manufacturer Part Number 1: CRGCQ0603J47R; Description 1: CRGCQ 0603 47R 5%; ComponentLink1Description: Datasheet; ComponentLink1URL: http://industrial.panasonic.com/www-cgi/jvcr13pz.cgi?E+PZ+3+AOA0002+ERJ3EKF1001V+7+WW; ComponentLink2Description: Digi-Key listing; ComponentLink2URL: http://digikey.com/product-detail/en/ERJ-3EKF1001V/P1.00KHTR-ND/196032; ComponentLink3URL: https://datasheet.ciiva.com/27055/1935748-27055113.pdf?src-supplier=Jameco; ComponentLink3Description: https://datasheet.ciiva.com/27055/1935748-27055113.pdf?src-supplier=Jameco; ComponentLink4URL: https://datasheet.ciiva.com/11808/0900766b80f806dd-11808207.pdf?src-supplier=RSComponents; ComponentLink4Description: https://datasheet.ciiva.com/11808/0900766b80f806dd-11808207.pdf?src-supplier=RSComponents; ComponentLink5URL: https://datasheet.ciiva.com/48532/aoa0000ce1-48532165.pdf?src-supplier=Avnet; ComponentLink5Description: https://datasheet.ciiva.com/48532/aoa0000ce1-48532165.pdf?src-supplier=Avnet; ComponentLink6URL: https://datasheet.ciiva.com/43460/1678796-43460647.pdf?src-supplier=Farnell; ComponentLink6Description: https://datasheet.ciiva.com/43460/1678796-43460647.pdf?src-supplier=Farnell; ComponentLink7URL: https://datasheet.ciiva.com/28695/1678796-28695833.pdf?src-supplier=Element14; ComponentLink7Description: https://datasheet.ciiva.com/28695/1678796-28695833.pdf?src-supplier=Element14; ComponentLink8URL: https://datasheet.ciiva.com/5959/1678796-5959707.pdf?src-supplier=Farnell; ComponentLink8Description: https://datasheet.ciiva.com/5959/1678796-5959707.pdf?src-supplier=Farnell; ComponentLink9URL: https://datasheet.ciiva.com/46377/1678796-46377868.pdf?src-supplier=Element14; ComponentLink9Description: https://datasheet.ciiva.com/46377/1678796-46377868.pdf?src-supplier=Element14; ComponentLink10URL: https://datasheet.ciiva.com/9198/aoa0000ce1-9198975.pdf?src-supplier=Avnet; ComponentLink10Description: https://datasheet.ciiva.com/9198/aoa0000ce1-9198975.pdf?src-supplier=Avnet; ComponentLink11URL: https://datasheet.ciiva.com/16758/70255313-16758527.pdf?src-supplier=Allied+Electronics; ComponentLink11Description: https://datasheet.ciiva.com/16758/70255313-16758527.pdf?src-supplier=Allied+Electronics; ComponentLink12URL: https://datasheet.ciiva.com/16834/aoa0000ce1-16834828.pdf?src-supplier=Future+Electronics; ComponentLink12Description: https://datasheet.ciiva.com/16834/aoa0000ce1-16834828.pdf?src-supplier=Future+Electronics; ComponentLink13URL: https://datasheet.ciiva.com/17215/aoa0000ce1-17215388.pdf?src-supplier=Avnet+Europe; ComponentLink13Description: https://datasheet.ciiva.com/17215/aoa0000ce1-17215388.pdf?src-supplier=Avnet+Europe; ComponentLink14URL: https://datasheet.ciiva.com/30199/4aoa0000ce1-30199822.pdf?src-supplier=Onlinecomponents.com; ComponentLink14Description: https://datasheet.ciiva.com/30199/4aoa0000ce1-30199822.pdf?src-supplier=Onlinecomponents.com; Supplier 1: Digi-Key; Supplier Part Number 1: A130083CT-ND; RoHS 1: No; Stock 1: 81962; Pricing 1: 1 = 0.10000, 10 = 0.02100, 100 = 0.00860, 1000 = 0.00387, 2500 = 0.00336 (USD); ComponentLink15URL: https://www.te.com/commerce/DocumentDelivery/DDEController?Action=srchrtrv&DocNm=1773204-3&DocType=DS&DocLang=English&src-supplier=Digi-Key; ComponentLink15Description: https://www.te.com/commerce/DocumentDelivery/DDEController?Action=srchrtrv&DocNm=1773204-3&DocType=DS&DocLang=English&src-supplier=Digi-Key
R11 R12 R44 = ERJ-8ENF1002V: RES SMD 10K OHM 1% 1/4W 1206; Manufacturer 1: Yageo; Manufacturer Part Number 1: RC1206FR-07200RL; Description 1: Res Thick Film 1206 200 Ohm 1% 0.25W(1/4W) ±100ppm/C Molded SMD Paper T/R; Temperature Coefficient: 100ppm/°C; Resistance: 200R; Voltage Rating (DC): 200V; Power Rating: 250mW; ComponentLink1Description: Datasheet; ComponentLink1URL: http://industrial.panasonic.com/www-cgi/jvcr13pz.cgi?E+PZ+3+AOA0002+ERJ8ENF1002V+7+WW; ComponentLink2Description: Digi-Key listing; ComponentLink2URL: http://digikey.com/product-detail/en/ERJ-8ENF1002V/P10.0KFTR-ND/89059; Supplier 1: Digi-Key; Supplier Part Number 1: 311-200FRCT-ND; RoHS 1: Yes; Stock 1: 2870115; Pricing 1: 1 = 0.10000, 10 = 0.07100, 100 = 0.02910, 1000 = 0.01306, 2500 = 0.01134 (USD); Mount: Surface Mount; Case/Package: 1206; Weight: 0.000571oz; Case Code (Metric): 3216; Case Code (Imperial): 1206; Min Operating Temperature: -55°C; Max Operating Temperature: 155°C; Composition: Thick Film; Packaging: Tape and Reel; Termination: SMD/SMT; Military Standard: Not; Voltage Rating: 200V; Length: 3.1mm; Height: 0.55mm; Width: 1.6mm; Depth: 1.6mm; Lead Free: Lead Free; ComponentLink3URL: https://datasheet.ciiva.com/11808/0900766b80c6630a-11808603.pdf?src-supplier=RSComponents; ComponentLink3Description: https://datasheet.ciiva.com/11808/0900766b80c6630a-11808603.pdf?src-supplier=RSComponents
SW1 = Tactle switch: Tactile Switch SPST-NO Top Actuated Surface Mount; Manufacturer 1: ITT C&K; Supplier 1: Digi-Key; Supplier Part Number 1: CKN12220-1-ND; RoHS 1: No; Stock 1: 5684; Pricing 1: 1 = 0.10000, 10 = 0.08500, 25 = 0.08240, 50 = 0.07940, 100 = 0.07500, 250 = 0.07064, 500 = 0.06768, 1000 = 0.05149 (USD); Manufacturer Part Number 1: PTS526SM15SMTR2LFS